# EAGLE design m_knife (EAGLE 7.7.0)
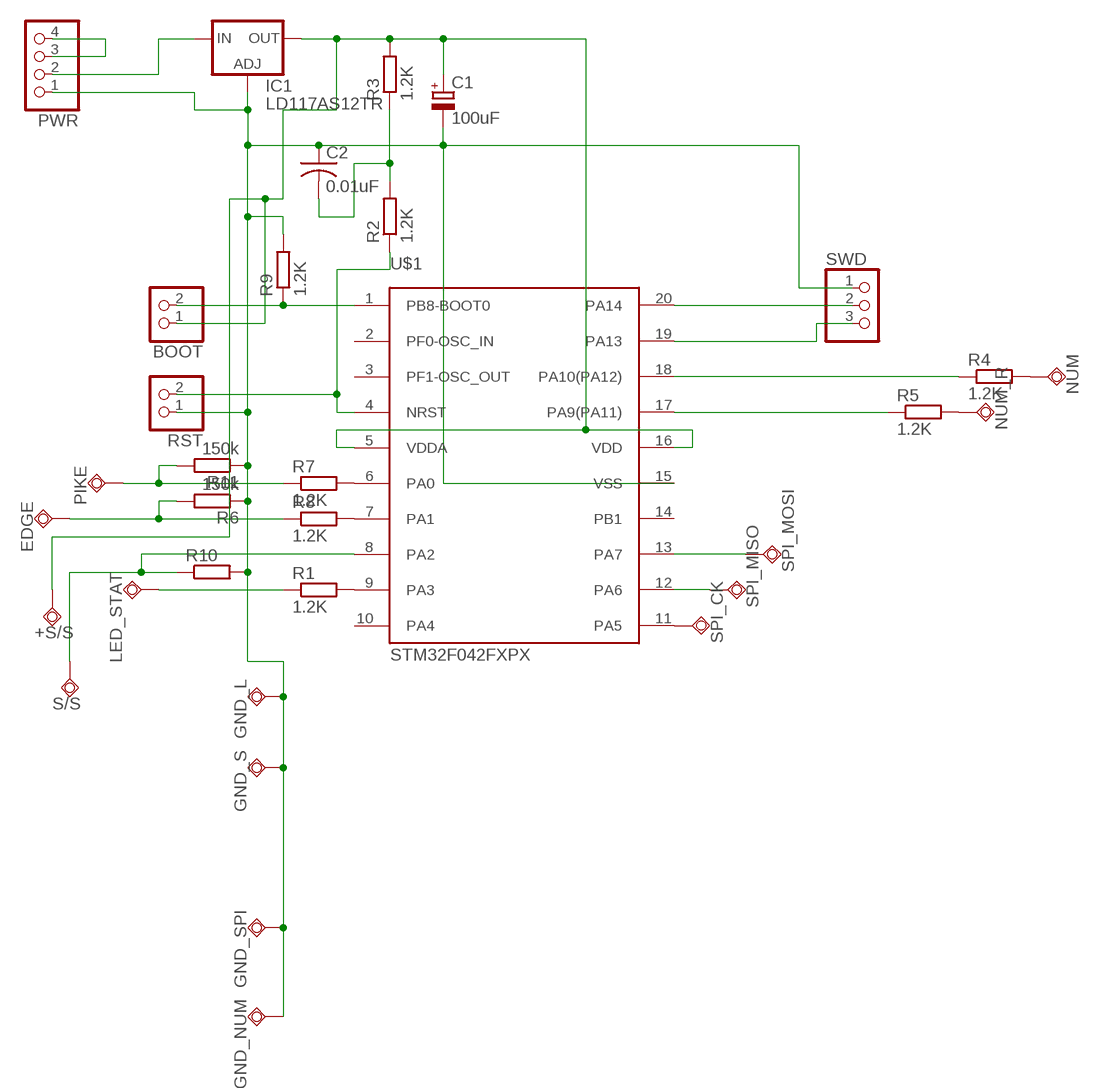
[diagram p0: schematic, sheet 1]

## Parts
+S/S  TPSQTP20R  [TP20R]
BOOT  PINHD-1X2  [1X02]
C1  100uF  CPOL-EUSMCD  [SMC_D]
C2  0.01uF  C-USC1206  [C1206]
EDGE  TPSQTP20R  [TP20R]
GND_L  TPSQTP20R  [TP20R]
GND_NUM  TPSQTP20R  [TP20R]
GND_S  TPSQTP20R  [TP20R]
GND_SPI  TPSQTP20R  [TP20R]
IC1  LD117AS12TR  [SOT223]
LED_STAT  TPSQTP20R  [TP20R]
NUM  TPSQTP20R  [TP20R]
NUM_R  TPSQTP20R  [TP20R]
PIKE  TPSQTP20R  [TP20R]
PWR  PINHD-1X4  [1X04]
R1  1.2K  R-EU_R1206  [R1206]
R2  1.2K  R-EU_R1206  [R1206]
R3  1.2K  R-EU_R1206  [R1206]
R4  1.2K  R-EU_R1206  [R1206]
R5  1.2K  R-EU_R1206  [R1206]
R6  150k  R-EU_R1206  [R1206]
R7  1.2K  R-EU_R1206  [R1206]
R8  1.2K  R-EU_R1206  [R1206]
R9  1.2K  R-EU_R1206  [R1206]
R10  R-EU_R1206  [R1206]
R11  150k  R-EU_R1206  [R1206]
RST  PINHD-1X2  [1X02]
S/S  TPSQTP20R  [TP20R]
SPI_CK  TPSQTP20R  [TP20R]
SPI_MISO  TPSQTP20R  [TP20R]
SPI_MOSI  TPSQTP20R  [TP20R]
SWD  PINHD-1X3  [1X03]
U$1  STM32F042FXPX  [TSSOP20]

## Nets
N$1: R7.2 U$1.6(PA0)
N$2: R8.2 U$1.7(PA1)
N$3: R1.2 U$1.9(PA3)
N$4: SPI_CK.TP U$1.11(PA5)
N$5: SPI_MISO.TP U$1.12(PA6)
N$6: SPI_MOSI.TP U$1.13(PA7)
N$7: R4.1 U$1.18(PA10(PA12))
N$9: NUM_R.TP R5.2
N$10: R10.1 S/S.TP U$1.8(PA2)
N$11: R2.1 RST.2 U$1.4(NRST)
N$12: BOOT.2 R9.1 U$1.1(PB8-BOOT0)
N$13: LED_STAT.TP R1.1
N$14: C1.- C2.1 GND_L.TP GND_NUM.TP GND_S.TP GND_SPI.TP IC1.1(ADJ) PWR.1 R6.1 R9.2 R10.2 R11.1 RST.1 SWD.1 U$1.15(VSS)
N$15: PWR.3 PWR.4
N$16: IC1.3(IN) PWR.2
N$17: +S/S.TP BOOT.1 C1.+ IC1.4(OUT) R3.2 U$1.5(VDDA) U$1.16(VDD)
N$18: NUM.TP R4.2
N$19: SWD.2 U$1.20(PA14)
N$20: SWD.3 U$1.19(PA13)
N$21: C2.2 R2.2 R3.1
N$22: R5.1 U$1.17(PA9(PA11))
N$24: PIKE.TP R7.1 R11.2
N$25: EDGE.TP R6.2 R8.1
Unconnected: U$1.2(PF0-OSC_IN) U$1.3(PF1-OSC_OUT) U$1.10(PA4) U$1.14(PB1)

## Library data of the parts
+S/S EDGE GND_L GND_NUM GND_S GND_SPI LED_STAT NUM NUM_R PIKE S/S SPI_CK SPI_MISO SPI_MOSI = testpad:TPSQ: Test pad
BOOT RST = pinhead:PINHD-1X2: PIN HEADER
C1 = rcl:CPOL-EU: POLARIZED CAPACITOR, European symbol
C2 = rcl:C-US: CAPACITOR, American symbol
IC1 = v-reg:LD117A?*: Low drop fixed and adjustable positive voltage regulators 1 A Source: http://www.st.com/stonline/products/literature/ds/7194/ld1117axx.pdf
PWR = pinhead:PINHD-1X4: PIN HEADER
R1-R11 = resistor:R-EU_: RESISTOR, European symbol
SWD = pinhead:PINHD-1X3: PIN HEADER
U$1 = stm32f0:STM32F042FXPX

## Board
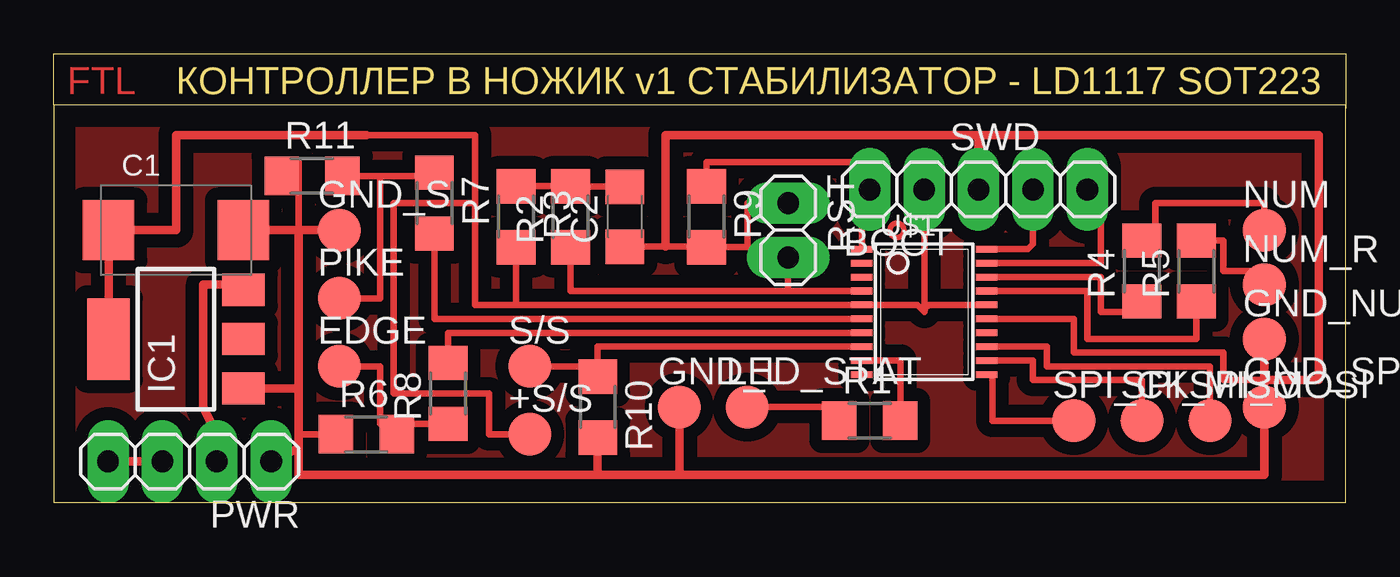
[diagram p1: board, top side]

Size 60.32 x 20.95 mm. Coordinates in mm from the lower left corner, seen from the top.
Outline: 0,18.54 60.32,18.54 60.32,0 0,0 0,18.54
Outline: 0,18.54 0,20.95 60.32,20.95 60.32,18.41
Copper layers (1*16): Top 0.035mm / dielectric 1.5mm / Bottom 0.035mm
Design rules "default *": minimum track width 10mil, minimum drill 24mil, track to track 8mil, track to pad 8mil, pad to pad 8mil, via to via 8mil, smd to smd 8mil, copper to edge 40mil, drill to drill 8mil, minimum pad ring 18mil, minimum via ring 8mil, stop-mask expansion 4mil, vias tented up to drill 0mil, thermal gap 10mil

### Footprints (pad centres in the part's own frame; a part is rotated, then mirrored left to right if it is on the bottom)
TP20R = smd 2 x 2: TP 0,0
1X02 = drill 1.016 long: 1 -1.27,0; 2 1.27,0
SMC_D = smd 2.4 x 2.8: + -3.15,0; - 3.15,0
C1206 = smd 1.6 x 1.8: 1 -1.4,0; 2 1.4,0
SOT223 = smd 1.5 x 2: 1 -2.3,-3.15; 2 0,-3.15; 3 2.3,-3.15 | smd 3.8 x 2: 4 0,3.15
1X04 = drill 1.016 long: 1 -3.81,0; 2 -1.27,0; 3 1.27,0; 4 3.81,0
R1206 = smd 1.6 x 1.803: 1 -1.422,0; 2 1.422,0
1X03 = drill 1.016 long: 1 -2.54,0; 2 0,0; 3 2.54,0
TSSOP20 = smd 0.305 x 0.991: 1 -2.925,-2.918; 2 -2.275,-2.918; 3 -1.625,-2.918; 4 -0.975,-2.918; 5 -0.325,-2.918; 6 0.325,-2.918; 7 0.975,-2.918; 8 1.625,-2.918; 9 2.275,-2.918; 10 2.925,-2.918; 11 2.925,2.918; 12 2.275,2.918; 13 1.625,2.918; 14 0.975,2.918; 15 0.325,2.918; 16 -0.325,2.918; 17 -0.975,2.918; 18 -1.625,2.918; 19 -2.275,2.918; 20 -2.925,2.918

### Placement (x,y rotation side)
+S/S  22.22,3.17 0 top
BOOT  39.37,14.61 180 top
C1  5.72,12.7 0 top
C2  26.67,13.33 90 top
EDGE  13.33,6.35 0 top
GND_L  29.21,4.45 0 top
GND_NUM  56.52,7.62 0 top
GND_S  13.33,12.7 0 top
GND_SPI  56.52,4.45 0 top
IC1  5.72,7.62 90 top
LED_STAT  32.39,4.45 0 top
NUM  56.52,12.7 0 top
NUM_R  56.52,10.16 0 top
PIKE  13.33,9.53 0 top
PWR  6.35,1.91 180 top
R1  38.1,3.81 0 top
R2  24.13,13.33 90 top
R3  21.59,13.33 270 top
R4  50.8,10.79 90 top
R5  53.34,10.79 90 top
R6  14.61,3.17 0 top
R7  17.78,13.97 270 top
R8  18.41,5.08 90 top
R9  30.48,13.33 270 top
R10  25.4,4.45 270 top
R11  12.06,15.24 0 top
RST  34.29,12.7 270 top
S/S  22.22,6.35 0 top
SPI_CK  47.62,3.81 0 top
SPI_MISO  50.8,3.81 0 top
SPI_MOSI  53.98,3.81 0 top
SWD  45.72,14.61 0 top
U$1  40.64,8.89 270 top

### Tracks (layer width: path | path; a pad name or v marks a point on that pad's centre or on a via)
N$1
  Top 0.305: U$1.6 17.78,8.56 R7.2
N$2
  Top 0.305: U$1.7 18.41,7.91 R8.2
N$3
  Top 0.305: R1.2 39.52,6.62 U$1.9
N$4
  Top 0.305: U$1.11 43.82,5.96 43.82,3.81 SPI_CK.TP
N$5
  Top 0.305: U$1.12 45.72,6.62 45.72,5.71 50.8,5.71 SPI_MISO.TP
N$6
  Top 0.305: U$1.13 46.36,7.27 46.36,6.35 53.98,6.35 SPI_MOSI.TP
N$7
  Top 0.305: U$1.18 48.9,10.51 48.9,8.89 51.44,8.89 R4.1
N$8
  pour Top (isolate 0.61): 0,18.41 60.32,18.41 60.32,0 0,0
N$9
  Top 0.305: R5.2 54.61,12.22 54.61,10.79 56.52,10.79 NUM_R.TP
N$10
  Top 0.305: S/S.TP 25.4,6.35 R10.1 25.4,7.27 U$1.8
N$11
  Top 0.305: 34.29,9.87 24.13,9.87 R2.1 | 34.29,9.87 U$1.4 | RST.2 34.29,9.87
N$12
  Top 0.305: U$1.1 37.72,15.24 BOOT.2 37.47,15.24 37.47,15.88 30.48,15.88 R9.1
N$13
  Top 0.305: R1.1 36.68,4.45 LED_STAT.TP
N$14
  Top 0.305: RST.1 32.39,13.97 32.39,11.91 R9.2 30.48,11.93 28.57,11.93 C2.1 | U$1.15 47.62,8.56 47.62,6.98 54.61,6.98 54.61,5.71 56.52,5.71 | R6.1 11.43,3.17 | R11.1 11.43,15.88 11.43,12.7
  Top 0.406: IC1.1 11.43,5.32 | 11.43,5.32 11.43,12.7 | 11.43,12.7 C1.- | GND_S.TP 11.43,12.7 | 25.4,1.27 R10.2 | 11.43,5.32 11.43,3.17 11.43,2.54 | 11.43,2.54 11.43,1.27 25.4,1.27 | PWR.1 11.43,2.54 | 29.21,1.27 56.52,1.27 GND_SPI.TP 56.52,5.71 | 29.21,1.27 25.4,1.27 | GND_NUM.TP 56.52,5.71 | GND_L.TP 29.21,1.27 | 43.18,17.14 28.57,17.14 28.57,11.93 | SWD.1 43.18,17.14 | 43.18,17.14 59.05,17.14 59.05,5.71 56.52,5.71
N$15
  Top 0.406: PWR.4 PWR.3
N$16
  Top 0.406: PWR.2 7.62,3.17 6.99,4.45 6.99,10.16 8.47,10.16 IC1.3
N$17
  Top 0.305: U$1.16 40.97,9.21 | 40.97,9.21 arc90 40.64,8.89 40.32,9.21 U$1.5 21.59,9.21 | BOOT.1 40.64,9.21 40.97,9.21 | 21.59,9.21 19.68,9.21 19.68,13.97 | R3.2 21.59,9.21 | 19.68,13.97 19.68,17.14 14.61,17.14 | +S/S.TP 20.32,3.17 20.32,5.08 15.88,5.08 15.88,13.97 19.68,13.97
  Top 0.406: IC1.4 C1.+ 5.72,12.7 5.72,17.14 14.61,17.14
N$18
  Top 0.305: R4.2 51.44,12.22 51.44,13.97 56.52,13.97 NUM.TP
N$19
  Top 0.305: U$1.20 45.47,11.81 45.72,12.06 SWD.2
N$20
  Top 0.305: U$1.19 48.9,11.16 48.9,14.61 SWD.3
N$21
  Top 0.305: C2.2 24.13,14.73 R2.2 R3.1
N$22
  Top 0.305: U$1.17 48.26,9.87 48.26,7.62 53.34,7.62 R5.1
N$24
  Top 0.305: PIKE.TP 15.24,9.53 15.24,15.24 | 15.24,15.24 17.78,15.24 R7.1 | R11.2 15.24,15.24
N$25
  Top 0.305: R8.1 16.03,3.66 | 16.03,3.66 R6.2 | 16.03,3.66 15.24,3.66 15.24,6.35 EDGE.TP
(copper drawn outside any net)
  shapes: Top circle x1

### Text on the board
Top: FTL
Dimension: КОНТРОЛЛЕР В НОЖИК v1 СТАБИЛИЗАТОР - LD1117 SOT223